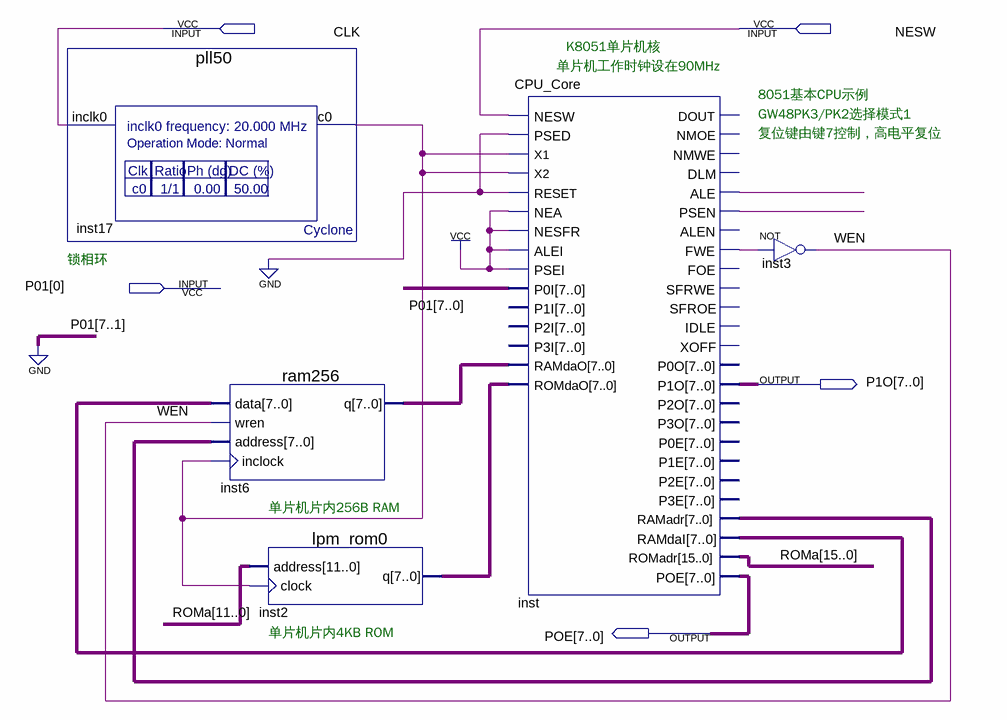
[diagram p0: schematic sheet]
// Quartus schematic MusicBlock.bdf as structural Verilog: 5 symbols, 5 pins
module MusicBlock (
  input  CLK,
  input  NESW,
  input  [0:0] P01,
  output [7:0] P1O,
  output [7:0] POE
);

  wire inst17_c0, inst_ale, inst_fwe, inst_psen, WEN;
  wire [7:0] inst2_q, inst6_q, inst_ramadr, inst_ramdai;
  wire [15:0] ROMa;

  pll50 inst17 (.inclk0(CLK), .c0(inst17_c0));
  ram256 inst6 (.data(inst_ramdai), .wren(WEN), .address(inst_ramadr), .inclock(inst17_c0), .q(inst6_q));
  lpm_rom0 inst2 (.address(ROMa[11:0]), .clock(inst17_c0), .q(inst2_q));
  CPU_Core inst (
    .NESW(NESW), .PSED(1'b0), .X1(inst17_c0), .X2(inst17_c0), .RESET(1'b0), .NEA(1'b1), .NESFR(1'b1),
    .ALEI(1'b1), .PSEI(1'b1), .P0I({{7{1'b0}}, P01[0]}), .RAMdaO(inst6_q), .ROMdaO(inst2_q), .ALE(inst_ale),
    .PSEN(inst_psen), .FWE(inst_fwe), .P1O(P1O), .RAMadr(inst_ramadr), .RAMdaI(inst_ramdai), .ROMadr(ROMa),
    .POE(POE));  // open: P1I, P2I, P3I, DOUT, NMOE, NMWE, DLM, ALEN, FOE, SFRWE, SFROE, IDLE, XOFF, P0O, P2O, P3O, P0E, P1E, P2E, P3E
  not inst3 (WEN, inst_fwe);

  // Notes on the sheet:
  //   K8051单片机核
  //   单片机工作时钟设在90MHz
  //   8051基本CPU示例
  //   GW48PK3/PK2选择模式1
  //   复位键由键7控制，高电平复位
  //   锁相环
  //   单片机片内256B RAM
  //   单片机片内4KB ROM
endmodule
